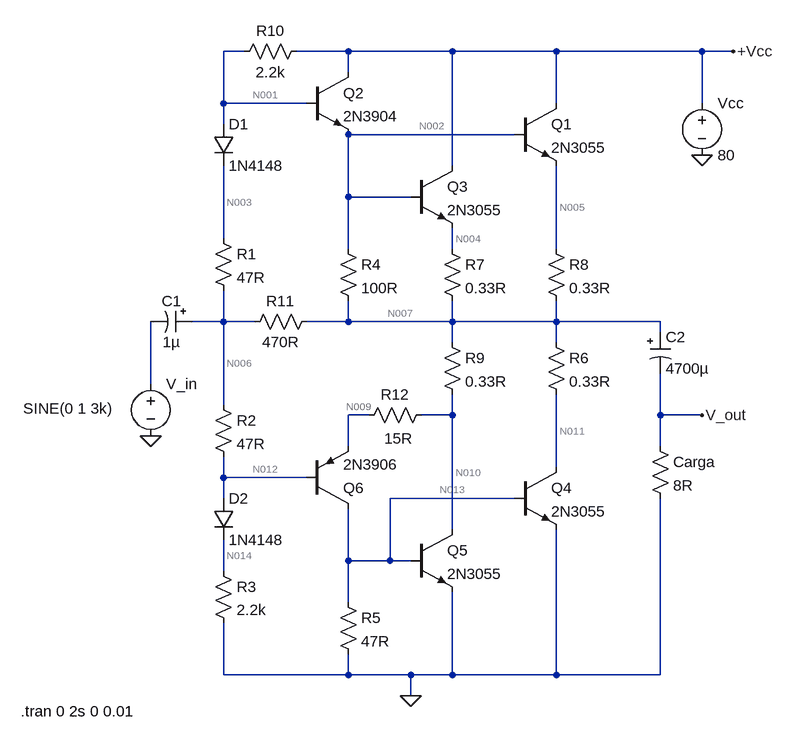
[diagram p0: schematic amp_90W_25volts.asc]
amp_90W_25volts.asc, the LTspice schematic file:
Version 4
SHEET 1 1400 968
WIRE 400 -448 368 -448
WIRE 560 -448 480 -448
WIRE 720 -448 560 -448
WIRE 880 -448 720 -448
WIRE 1104 -448 880 -448
WIRE 1152 -448 1104 -448
WIRE 560 -416 560 -448
WIRE 368 -368 368 -448
WIRE 496 -368 368 -368
WIRE 880 -368 880 -448
WIRE 1104 -368 1104 -448
WIRE 368 -336 368 -368
WIRE 816 -320 560 -320
WIRE 720 -272 720 -448
WIRE 560 -224 560 -320
WIRE 656 -224 560 -224
WIRE 368 -160 368 -272
WIRE 560 -144 560 -224
WIRE 720 -144 720 -176
WIRE 880 -144 880 -272
WIRE 368 -32 368 -80
WIRE 368 -32 320 -32
WIRE 416 -32 368 -32
WIRE 560 -32 560 -64
WIRE 560 -32 496 -32
WIRE 720 -32 720 -64
WIRE 720 -32 560 -32
WIRE 880 -32 880 -64
WIRE 880 -32 720 -32
WIRE 1040 -32 880 -32
WIRE 1040 -16 1040 -32
WIRE 720 0 720 -32
WIRE 880 0 880 -32
WIRE 256 64 256 -32
WIRE 368 96 368 -32
WIRE 592 112 560 112
WIRE 720 112 720 80
WIRE 720 112 672 112
WIRE 1040 112 1040 48
WIRE 1104 112 1040 112
WIRE 560 160 560 112
WIRE 1040 160 1040 112
WIRE 880 192 880 80
WIRE 368 208 368 176
WIRE 496 208 368 208
WIRE 368 240 368 208
WIRE 816 240 624 240
WIRE 720 288 720 112
WIRE 560 336 560 256
WIRE 624 336 624 240
WIRE 624 336 560 336
WIRE 656 336 624 336
WIRE 368 352 368 304
WIRE 560 400 560 336
WIRE 368 512 368 432
WIRE 560 512 560 480
WIRE 560 512 368 512
WIRE 656 512 560 512
WIRE 720 512 720 384
WIRE 720 512 656 512
WIRE 880 512 880 288
WIRE 880 512 720 512
WIRE 1040 512 1040 240
WIRE 1040 512 880 512
WIRE 656 544 656 512
FLAG 1152 -448 +Vcc
FLAG 656 544 0
FLAG 1104 -288 0
FLAG 256 144 0
FLAG 1104 112 V_out
SYMBOL npn 496 -416 R0
SYMATTR InstName Q2
SYMATTR Value 2N3904
SYMBOL npn 816 -368 R0
SYMATTR InstName Q1
SYMATTR Value 2N3055
SYMBOL npn 656 -272 R0
SYMATTR InstName Q3
SYMATTR Value 2N3055
SYMBOL npn 816 192 R0
SYMATTR InstName Q4
SYMATTR Value 2N3055
SYMBOL npn 656 288 R0
SYMATTR InstName Q5
SYMATTR Value 2N3055
SYMBOL diode 352 -336 R0
SYMATTR InstName D1
SYMATTR Value 1N4148
SYMBOL diode 352 240 R0
SYMATTR InstName D2
SYMATTR Value 1N4148
SYMBOL polcap 320 -48 R90
WINDOW 0 0 32 VBottom 2
WINDOW 3 32 32 VTop 2
SYMATTR InstName C1
SYMATTR Value 1µ
SYMATTR Description Capacitor
SYMATTR Type cap
SYMATTR SpiceLine V=50 Irms=12m Rser=22 Lser=0 mfg="Nichicon" pn="UPR1H010MAH" type="Al electrolytic"
SYMBOL polcap 1024 -16 R0
WINDOW 3 24 56 Left 2
SYMATTR Value 4700µ
SYMATTR InstName C2
SYMATTR Description Capacitor
SYMATTR Type cap
SYMATTR SpiceLine V=25 Irms=2.96 Rser=0.018 Lser=0 mfg="Nichicon" pn="UPL1E472MRH" type="Al electrolytic"
SYMBOL res 352 -176 R0
SYMATTR InstName R1
SYMATTR Value 47R
SYMBOL res 352 80 R0
SYMATTR InstName R2
SYMATTR Value 47R
SYMBOL res 352 336 R0
SYMATTR InstName R3
SYMATTR Value 2.2k
SYMBOL res 544 -160 R0
SYMATTR InstName R4
SYMATTR Value 100R
SYMBOL res 544 384 R0
SYMATTR InstName R5
SYMATTR Value 47R
SYMBOL res 864 -16 R0
SYMATTR InstName R6
SYMATTR Value 0.33R
SYMBOL res 704 -160 R0
SYMATTR InstName R7
SYMATTR Value 0.33R
SYMBOL res 864 -160 R0
SYMATTR InstName R8
SYMATTR Value 0.33R
SYMBOL res 704 -16 R0
SYMATTR InstName R9
SYMATTR Value 0.33R
SYMBOL res 496 -464 R90
WINDOW 0 0 56 VBottom 2
WINDOW 3 32 56 VTop 2
SYMATTR InstName R10
SYMATTR Value 2.2k
SYMBOL res 512 -48 R90
WINDOW 0 0 56 VBottom 2
WINDOW 3 32 56 VTop 2
SYMATTR InstName R11
SYMATTR Value 470R
SYMBOL res 688 96 R90
WINDOW 0 0 56 VBottom 2
WINDOW 3 36 51 VTop 2
SYMATTR InstName R12
SYMATTR Value 15R
SYMBOL pnp 496 256 M180
SYMATTR InstName Q6
SYMATTR Value 2N3906
SYMBOL voltage 1104 -384 R0
WINDOW 123 0 0 Left 2
WINDOW 39 0 0 Left 2
SYMATTR InstName Vcc
SYMATTR Value 80
SYMBOL voltage 256 48 R0
WINDOW 3 -196 54 Left 2
WINDOW 123 0 0 Left 2
WINDOW 39 0 0 Left 2
SYMATTR Value SINE(0 1 3k)
SYMATTR InstName V_in
SYMBOL res 1024 144 R0
SYMATTR InstName Carga
SYMATTR Value 8R
TEXT 56 568 Left 2 !.tran 0 2s 0 0.01

The netlist it stands for:
* amp_90W_25volts.asc
Q2 +Vcc N001 N002 0 2N3904
Q1 +Vcc N002 N005 0 2N3055
Q3 +Vcc N002 N004 0 2N3055
Q4 N011 N013 0 0 2N3055
Q5 N010 N013 0 0 2N3055
D1 N001 N003 1N4148
D2 N012 N014 1N4148
C1 N006 N008 1µ V=50 Irms=12m Rser=22 Lser=0 mfg="Nichicon" pn="UPR1H010MAH" type="Al electrolytic"
C2 N007 V_out 4700µ V=25 Irms=2.96 Rser=0.018 Lser=0 mfg="Nichicon" pn="UPL1E472MRH" type="Al electrolytic"
R1 N003 N006 47R
R2 N006 N012 47R
R3 N014 0 2.2k
R4 N002 N007 100R
R5 N013 0 47R
R6 N007 N011 0.33R
R7 N004 N007 0.33R
R8 N005 N007 0.33R
R9 N007 N010 0.33R
R10 +Vcc N001 2.2k
R11 N007 N006 470R
R12 N010 N009 15R
Q6 N013 N012 N009 0 2N3906
Vcc +Vcc 0 80
V_in N008 0 SINE(0 1 3k)
R§Carga V_out 0 8R
.model D D
.lib standard.dio
.model NPN NPN
.model PNP PNP
.lib standard.bjt
.tran 0 2s 0 0.01
.backanno
.end

* Results of the author's LTspice run, read from the files saved beside the schematic
* Operating Point, zero values left out:
*   V(+vcc) = 80 V
*   V(n001) = 42.23 V
*   V(n002) = 41.51 V
*   V(n005) = 41.08 V
*   V(n004) = 41.08 V
*   V(n011) = 40.89 V
*   V(n013) = 432 mV
*   V(n010) = 40.89 V
*   V(n003) = 41.51 V
*   V(n012) = 39.87 V
*   V(n014) = 39.15 V
*   V(n006) = 40.71 V
*   V(n007) = 40.99 V
*   V(n009) = 40.6 V
*   Ic(Q6) = -19.06 mA
*   Ib(Q6) = -70.69 µA
*   Ie(Q6) = 19.13 mA
*   Ic(Q5) = 281.2 mA
*   Ib(Q5) = 4.935 mA
*   Ie(Q5) = -286.1 mA
*   Ic(Q4) = 281.2 mA
*   Ib(Q4) = 4.935 mA
*   Ie(Q4) = -286.1 mA
*   Ic(Q3) = 283.5 mA
*   Ib(Q3) = 4.983 mA
*   Ie(Q3) = -288.4 mA
*   Ic(Q1) = 283.5 mA
*   Ib(Q1) = 4.983 mA
*   Ie(Q1) = -288.4 mA
*   Ic(Q2) = 15.2 mA
*   Ib(Q2) = 37.8 µA
*   Ie(Q2) = -15.24 mA
*   I(D2) = 17.79 mA
*   I(D1) = 17.13 mA
*   I(R12) = 19.13 mA
*   I(R11) = 595.8 µA
*   I(R10) = 17.17 mA
*   I(R9) = 300.3 mA
*   I(R8) = 288.4 mA
*   I(R7) = 288.4 mA
*   I(R6) = 281.2 mA
*   I(R5) = 9.191 mA
*   I(R4) = 5.274 mA
*   I(R3) = 17.79 mA
*   I(R2) = 17.72 mA
*   I(R1) = 17.13 mA
*   I(Vcc) = -599.3 mA